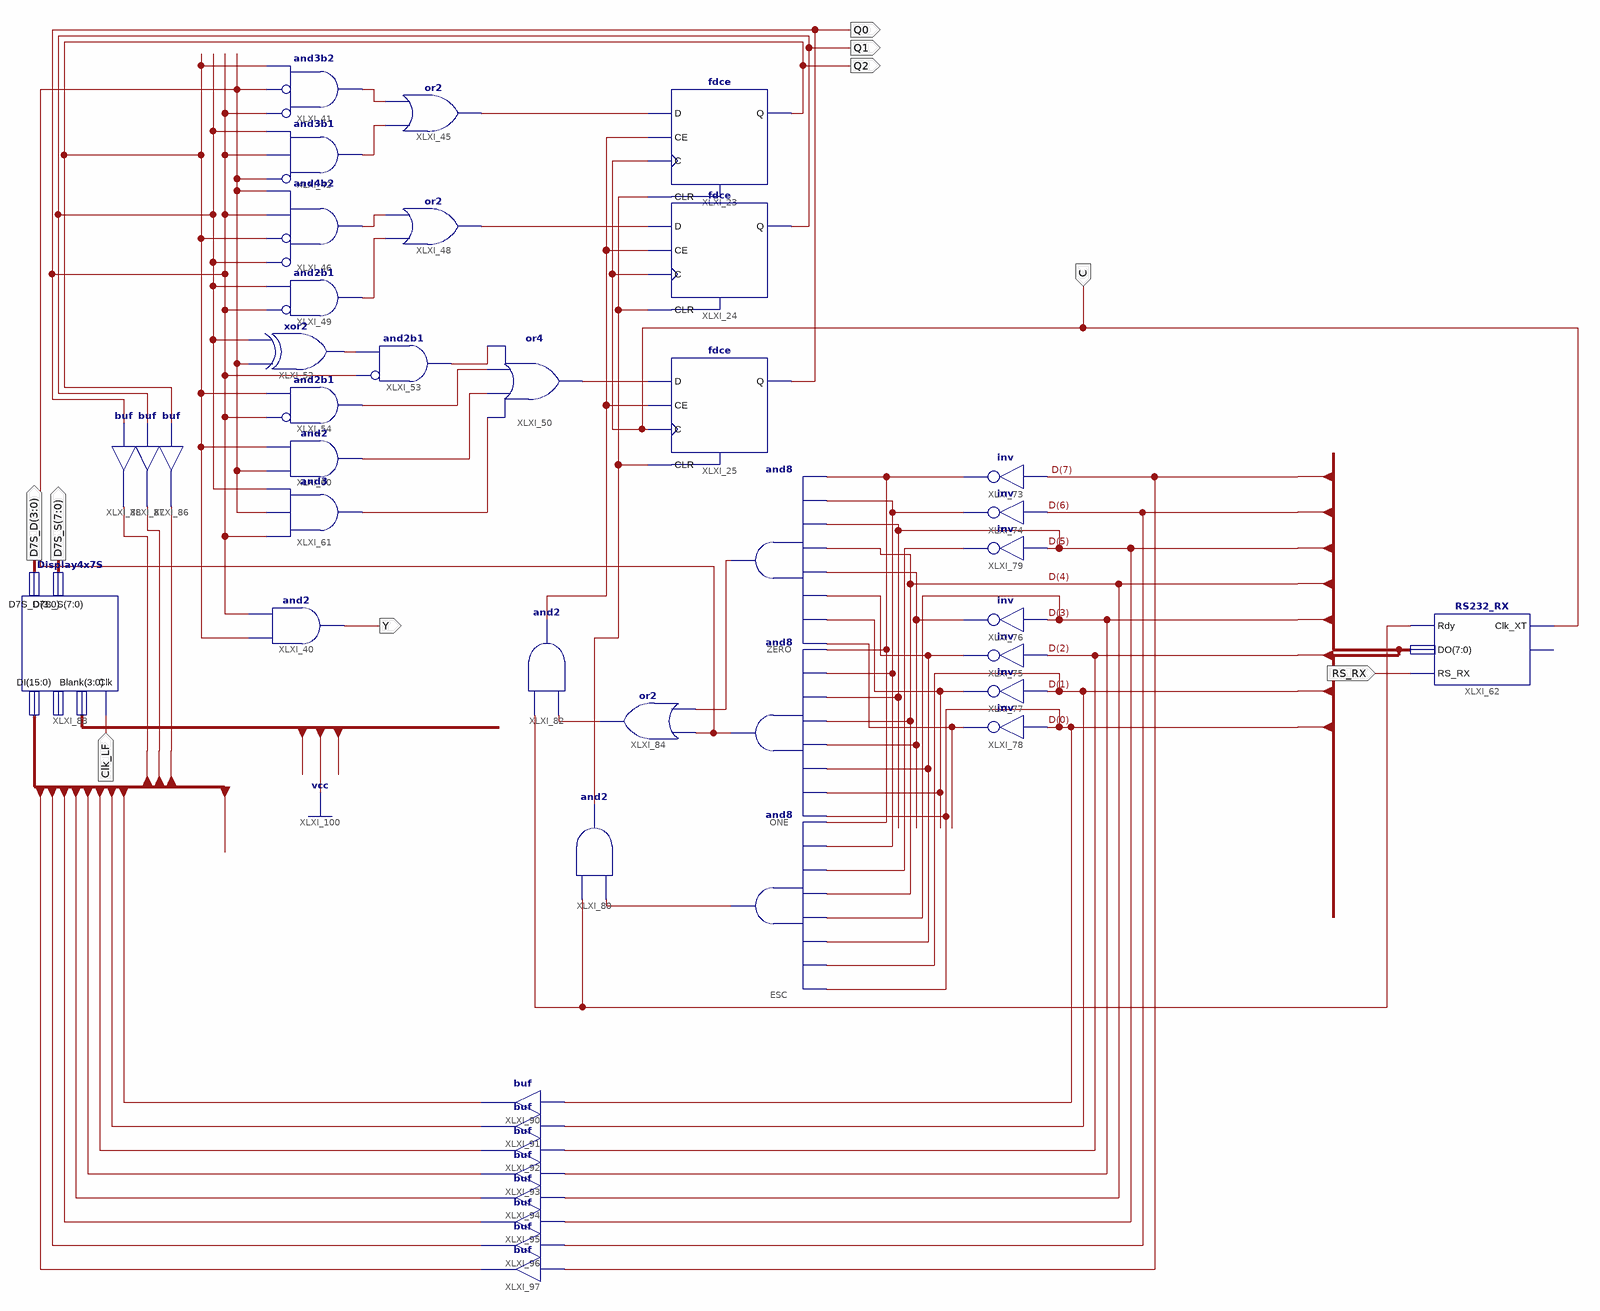
[diagram p0: schematic sheet 1]
// Xilinx ISE schematic lab4.sch (xc9500xl) as structural Verilog: 42 symbols, 9 ports
module lab4 (
  input  C,
  input  RS_RX,
  input  Clk_LF,
  output Q2,
  output Q0,
  output Q1,
  output Y,
  output [3:0] D7S_D,
  output [7:0] D7S_S
);

  wire CE, X, XLXN_53, XLXN_54, XLXN_55, XLXN_100, XLXN_101, XLXN_102, XLXN_103, XLXN_104, XLXN_105,
       XLXN_116, XLXN_117, XLXN_118, XLXN_186, XLXN_187, XLXN_191, XLXN_193, XLXN_194, XLXN_195, XLXN_215,
       XLXN_217, XLXN_228, XLXN_231, XLXN_1234, XLXN_1237;
  wire [3:0] Blank;
  wire [7:0] D;
  wire [15:0] DI;

  fdce XLXI_23 (.C(C), .CE(CE), .CLR(XLXN_1237), .D(XLXN_53), .Q(Q2));
  fdce XLXI_24 (.C(C), .CE(CE), .CLR(XLXN_1237), .D(XLXN_54), .Q(Q1));
  fdce XLXI_25 (.C(C), .CE(CE), .CLR(XLXN_1237), .D(XLXN_55), .Q(Q0));
  and XLXI_41 (XLXN_100, ~Q0, ~X, Q2);  // and3b2
  and XLXI_42 (XLXN_101, ~X, Q0, Q1);  // and3b1
  or XLXI_45 (XLXN_53, XLXN_101, XLXN_100);
  and XLXI_46 (XLXN_102, ~Q1, ~Q2, Q0, X);  // and4b2
  or XLXI_48 (XLXN_54, XLXN_103, XLXN_102);
  and XLXI_49 (XLXN_103, ~Q0, Q1);  // and2b1
  xor XLXI_52 (XLXN_104, X, Q1);
  and XLXI_53 (XLXN_105, ~Q0, XLXN_104);  // and2b1
  and XLXI_54 (XLXN_116, ~Q0, Q2);  // and2b1
  and XLXI_40 (Y, Q2, Q0);
  and XLXI_60 (XLXN_117, X, Q2);
  and XLXI_61 (XLXN_118, Q0, X, Q1);
  and ZERO (XLXN_215, XLXN_186, XLXN_187, D[5], D[4], XLXN_191, XLXN_193, XLXN_194, XLXN_195);
  and ONE (X, XLXN_186, XLXN_187, D[5], D[4], XLXN_191, XLXN_193, XLXN_194, D[0]);
  and ESC (XLXN_1234, XLXN_186, XLXN_187, XLXN_228, D[4], D[3], XLXN_193, D[1], D[0]);
  not XLXI_73 (XLXN_186, D[7]);
  not XLXI_74 (XLXN_187, D[6]);
  not XLXI_75 (XLXN_193, D[2]);
  not XLXI_76 (XLXN_191, D[3]);
  not XLXI_77 (XLXN_194, D[1]);
  not XLXI_78 (XLXN_195, D[0]);
  not XLXI_79 (XLXN_228, D[5]);
  and XLXI_80 (XLXN_1237, XLXN_1234, XLXN_231);
  and XLXI_82 (CE, XLXN_217, XLXN_231);
  or XLXI_50 (XLXN_55, XLXN_118, XLXN_117, XLXN_116, XLXN_105);
  Display4x7S XLXI_83 (
    .DI(DI), .D7S_D(D7S_D), .D7S_S(D7S_S), .Clk(Clk_LF), .Blank({Blank[3:2], 1'b1, Blank[0]}));  // open: DP
  or XLXI_84 (XLXN_217, XLXN_215, X);
  buf XLXI_86 (DI[2], Q2);
  buf XLXI_87 (DI[1], Q1);
  buf XLXI_88 (DI[0], Q0);
  RS232_RX XLXI_62 (.Clk_XT(C), .Rdy(XLXN_231), .DO(D), .RS_RX(RS_RX));  // open: Reset
  buf XLXI_91 (DI[9], D[1]);
  buf XLXI_92 (DI[10], D[2]);
  buf XLXI_93 (DI[11], D[3]);
  buf XLXI_94 (DI[12], D[4]);
  buf XLXI_95 (DI[13], D[5]);
  buf XLXI_96 (DI[14], D[6]);
  buf XLXI_97 (DI[15], D[7]);
  buf XLXI_90 (DI[8], D[0]);
endmodule
